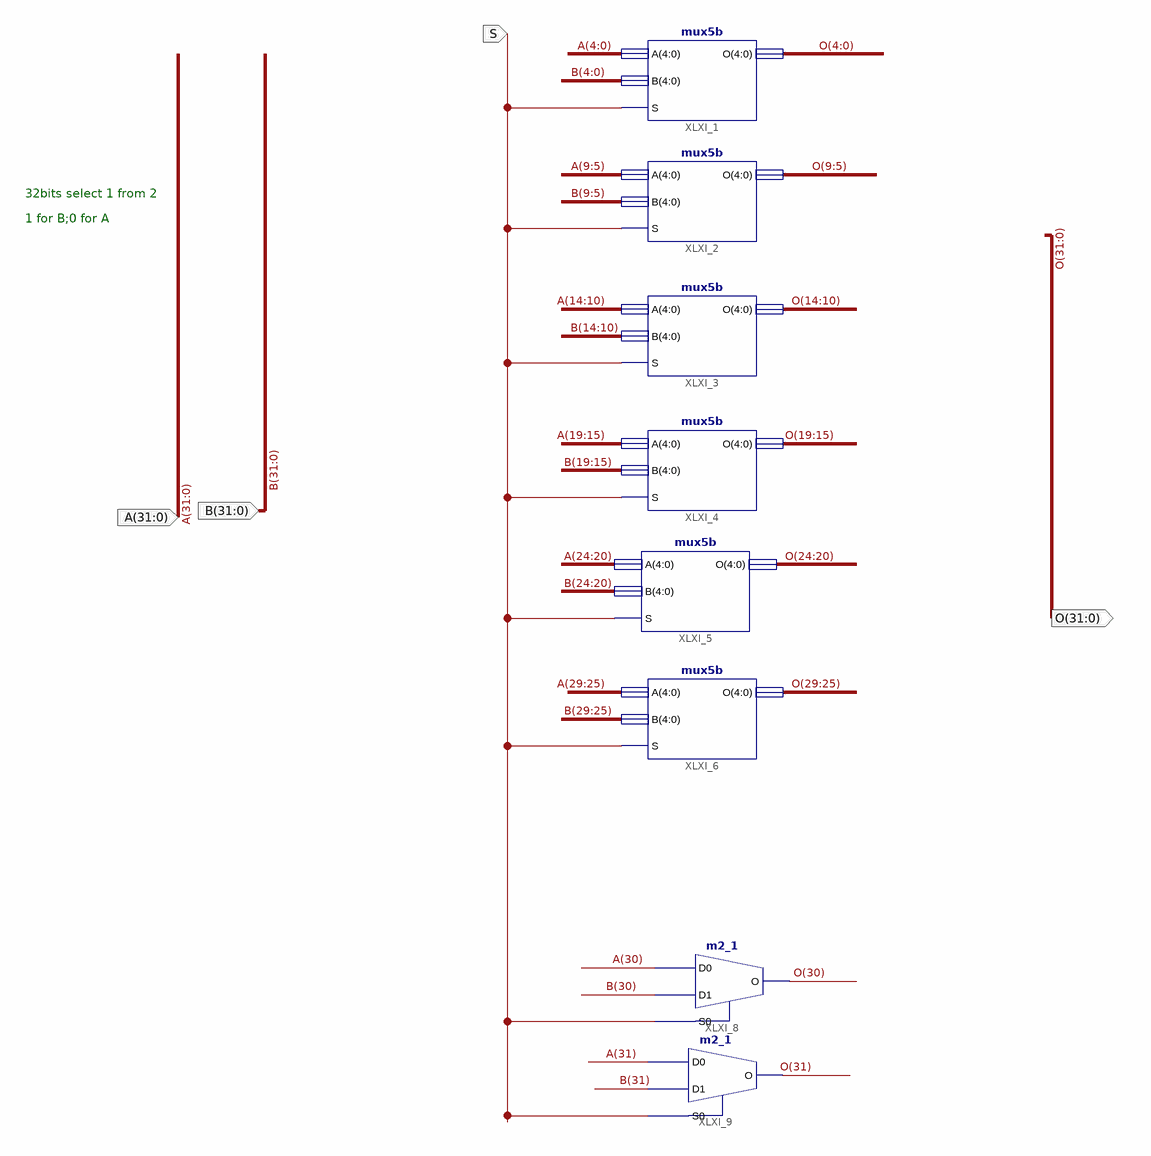
[diagram p0: schematic sheet 1]
// Xilinx ISE schematic mux32.sch (artix7) as structural Verilog: 8 symbols, 4 ports
module mux32 (
  input  [31:0] A,
  input  [31:0] B,
  input  S,
  output [31:0] O
);

  mux5b XLXI_1 (.A(A[4:0]), .B(B[4:0]), .S(S), .O(O[4:0]));
  mux5b XLXI_2 (.A(A[9:5]), .B(B[9:5]), .S(S), .O(O[9:5]));
  mux5b XLXI_3 (.A(A[14:10]), .B(B[14:10]), .S(S), .O(O[14:10]));
  mux5b XLXI_4 (.A(A[19:15]), .B(B[19:15]), .S(S), .O(O[19:15]));
  mux5b XLXI_5 (.A(A[24:20]), .B(B[24:20]), .S(S), .O(O[24:20]));
  mux5b XLXI_6 (.A(A[29:25]), .B(B[29:25]), .S(S), .O(O[29:25]));
  m2_1 XLXI_8 (.D0(A[30]), .D1(B[30]), .S0(S), .O(O[30]));
  m2_1 XLXI_9 (.D0(A[31]), .D1(B[31]), .S0(S), .O(O[31]));

  // Notes on the sheet:
  //   32bits select 1 from 2
  //   1 for B;0 for A
endmodule
